# EAGLE design MRF24J40MA Breakout verA (EAGLE 6.4)
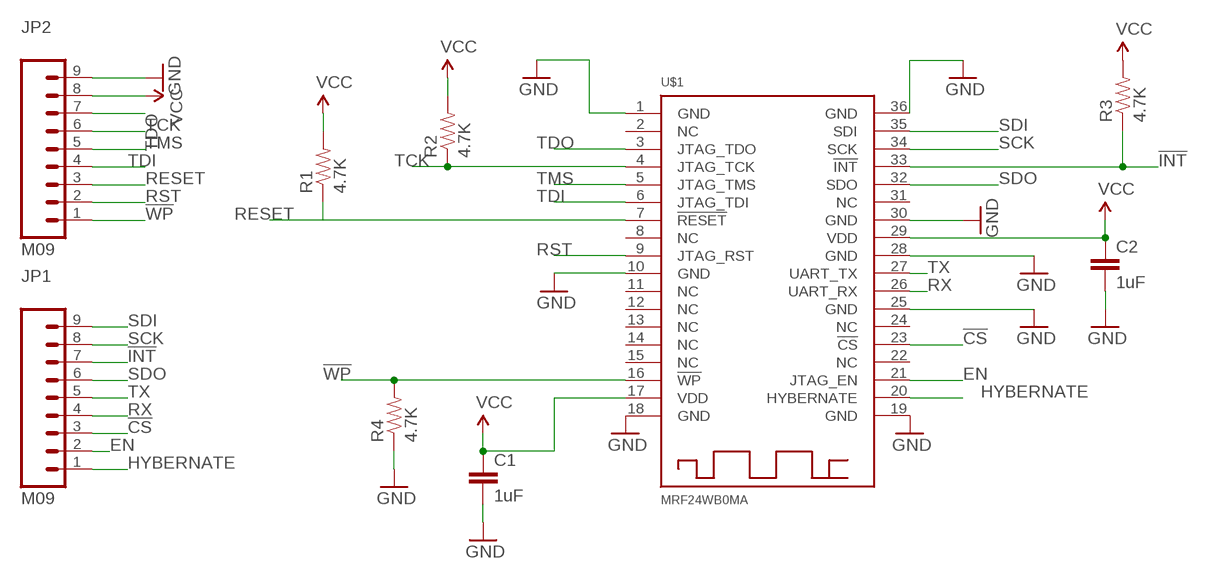
[diagram p0: schematic, sheet 1]

## Parts
C1  1uF  CAP0603-CAP  [0603-CAP]
C2  1uF  CAP0603-CAP  [0603-CAP]
JP1  M09  [1X09]
JP2  M09  [1X09]
R1  4.7K  RESISTOR0603-RES  [0603-RES]
R2  4.7K  RESISTOR0603-RES  [0603-RES]
R3  4.7K  RESISTOR0603-RES  [0603-RES]
R4  4.7K  RESISTOR0603-RES  [0603-RES]
U$1  MRF24WB0MA  [MRF24WB0MA]

## Nets
!CS: JP1.3 U$1.23(!CS)
!INT: JP1.7 R3.1 U$1.33(!INT)
!WP: JP2.1 R4.2 U$1.16(!WP)
EN: JP1.2 U$1.21(JTAG_EN)
GND: C1.2 C2.2 JP2.9 R4.1 U$1.1(GND) U$1.10(GND) U$1.18(GND) U$1.19(GND) U$1.25(GND) U$1.28(GND) U$1.30(GND) U$1.36(GND)
HYBERNATE: JP1.1 U$1.20(HYBERNATE)
RESET: JP2.3 R1.1 U$1.7(!RESET)
RST: JP2.2 U$1.9(JTAG_RST)
RX: JP1.4 U$1.26(UART_RX)
SCK: JP1.8 U$1.34(SCK)
SDI: JP1.9 U$1.35(SDI)
SDO: JP1.6 U$1.32(SDO)
TCK: JP2.6 R2.1 U$1.4(JTAG_TCK)
TDI: JP2.4 U$1.6(JTAG_TDI)
TDO: JP2.7 U$1.3(JTAG_TDO)
TMS: JP2.5 U$1.5(JTAG_TMS)
TX: JP1.5 U$1.27(UART_TX)
VCC: C1.1 C2.1 JP2.8 R1.2 R2.2 R3.2 U$1.17(VDD) U$1.29(VDD)
Unconnected: U$1.2(NC) U$1.8(NC) U$1.11(NC) U$1.12(NC) U$1.13(NC) U$1.14(NC) U$1.15(NC) U$1.22(NC) U$1.24(NC) U$1.31(NC)

## Library data of the parts
C1 C2 = SparkFun-Passives:CAP: Capacitor Standard 0603 ceramic capacitor, and 0.1" leaded capacitor.
JP1 JP2 = SparkFun-Connectors:M09: Header 9 Standard 9-pin 0.1" header. Use with straight break away headers (SKU : PRT-00116), right angle break away headers (PRT-00553), swiss pins (PRT-00743), machine pins (PRT-00117), and female headers (PRT-00115).
R1-R4 = SparkFun-Passives:RESISTOR: Resistor Basic schematic elements and footprints for 0603, 1206, and PTH resistors.
U$1 = mrf24wb0ma:MRF24WB0MA

## Board
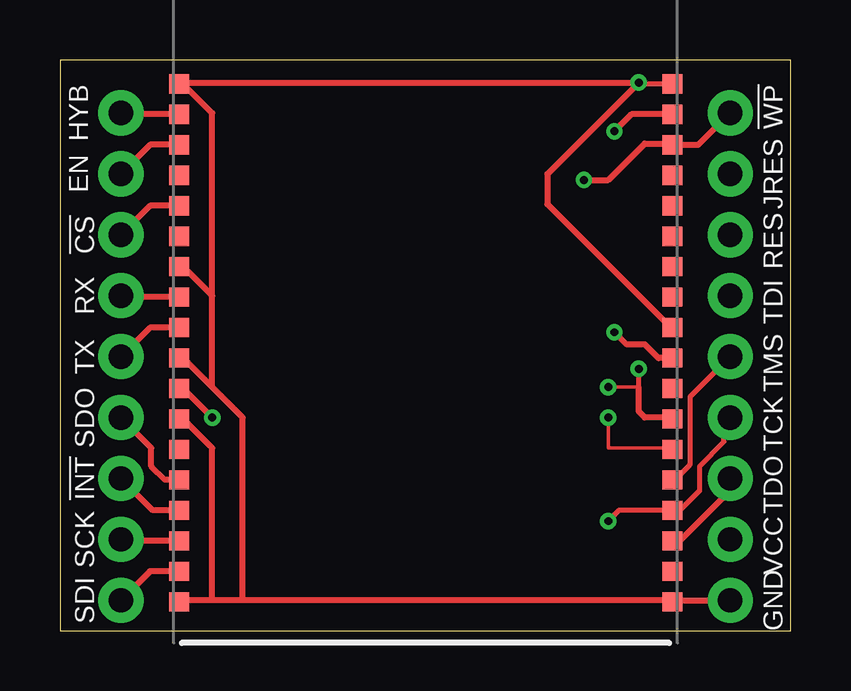
[diagram p1: board, top side]
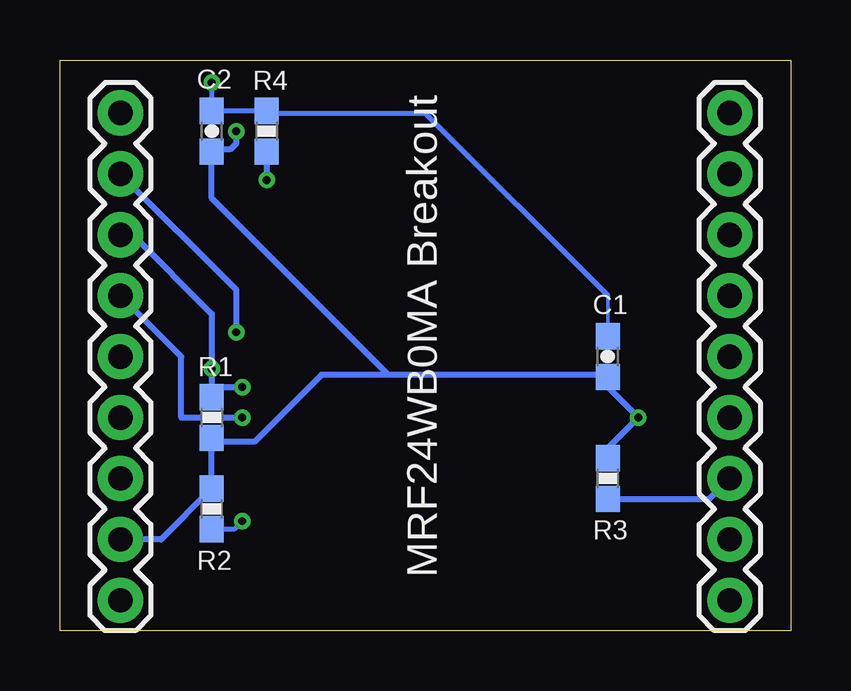
[diagram p2: board, bottom side, seen from below]

Size 30.46 x 23.8 mm. Coordinates in mm from the lower left corner, seen from the top.
Outline: 0,0 30.46,0 30.46,23.8 0,23.8 0,0
Copper layers (1*16): Top 0.0356mm / dielectric 1.5011mm / Bottom 0.0356mm
Design rules "LaenPCBOrder": minimum track width 6mil, minimum drill 13mil, track to track 6mil, track to pad 6mil, pad to pad 6mil, via to via 6mil, smd to smd 6mil, copper to edge 15mil, drill to drill 6mil, minimum pad ring 7mil, minimum via ring 7mil, stop-mask expansion 4mil, vias tented up to drill 13mil, thermal gap 10mil

### Footprints (pad centres in the part's own frame; a part is rotated, then mirrored left to right if it is on the bottom)
0603-CAP = smd 1.1 x 1: 1 -0.85,0; 2 0.85,0
1X09 = drill 1.016 pad 1.88: 1 0,0; 2 2.54,0; 3 5.08,0; 4 7.62,0; 5 10.16,0; 6 12.7,0; 7 15.24,0; 8 17.78,0; 9 20.32,0
0603-RES = smd 1.1 x 1: 1 -0.85,0; 2 0.85,0
MRF24WB0MA = smd 0.85 x 0.8: 1 -10.29,12.76; 2 -10.29,11.49; 3 -10.29,10.22; 4 -10.29,8.95; 5 -10.29,7.68; 6 -10.29,6.41; 7 -10.29,5.14; 8 -10.29,3.87; 9 -10.29,2.6; 10 -10.29,1.33; 11 -10.29,0.06; 12 -10.29,-1.21; 13 -10.29,-2.48; 14 -10.29,-3.75; 15 -10.29,-5.02; 16 -10.29,-6.29; 17 -10.29,-7.56; 18 -10.29,-8.83; 19 10.27,-8.83; 20 10.27,-7.56; 21 10.27,-6.29; 22 10.27,-5.02; 23 10.27,-3.75; 24 10.27,-2.48; 25 10.27,-1.21; 26 10.27,0.06; 27 10.27,1.33; 28 10.27,2.6; 29 10.27,3.87; 30 10.27,5.14; 31 10.27,6.41; 32 10.27,7.68; 33 10.27,8.95; 34 10.27,10.22; 35 10.27,11.49; 36 10.27,12.76

### Placement (x,y rotation side)
C1  7.62,11.43 90 bottom
C2  24.13,20.83 90 bottom
JP1  2.54,21.59 270 bottom
JP2  27.94,21.59 270 bottom
R1  24.13,8.89 270 bottom
R2  24.13,5.08 90 bottom
R3  7.62,6.35 90 bottom
R4  21.84,20.83 270 bottom
U$1  15.24,13.97 180 top

### Tracks (layer width: path | path; a pad name or v marks a point on that pad's centre or on a via)
!CS
  Top 0.254: U$1.23 3.75,17.72 JP1.3
!INT
  Top 0.254: U$1.33 3.87,5.02 JP1.7
  Bottom 0.254: R3.1 3.39,5.5 JP1.7
!WP  (via drill 0.33)
  Top 0.203: 25.47,20.32 U$1.16
  Top 0.254: U$1.16 26.61,20.26 JP2.1 | v21.84,18.8 22.86,18.8 24.38,20.32 25.47,20.32
  Bottom 0.254: R4.2 v21.84,18.8
EN
  Top 0.254: U$1.21 3.75,20.26 JP1.2
GND  (via drill 0.33)
  Top 0.152: 25.4,12.7 U$1.10 | 5.08,1.27 U$1.36 | 25.4,1.27 U$1.1 | 5.08,8.89 U$1.30 | 5.08,11.43 U$1.28 | 5.08,15.24 U$1.25 | 5.08,22.86 U$1.19
  Top 0.203: U$1.18 24.32,22.8 v24.13,22.86
  Top 0.254: 25.4,12.7 20.32,17.78 20.32,19.05 v24.13,22.86 5.08,22.86 6.35,21.59 6.35,13.97 | 25.4,1.27 7.62,1.27 | 7.62,1.27 6.35,1.27 | 6.35,1.27 5.08,1.27 | 5.08,8.89 6.35,7.62 6.35,1.27 | 6.35,10.16 7.62,8.89 7.62,1.27 | 6.35,10.16 5.08,11.43 | 6.35,13.97 5.08,15.24 | 6.35,10.16 6.35,13.97 | U$1.1 25.59,1.27 JP2.9
  Bottom 0.152: 7.62,13.97 C1.2 | 21.59,21.59 R4.1
  Bottom 0.203: v24.13,22.86 C2.2 R4.1 | 7.62,13.97 15.24,21.59 21.59,21.59
HYBERNATE
  Top 0.254: U$1.20 2.6,21.53 JP1.1
RESET  (via drill 0.33)
  Top 0.152: v22.86,10.16 24.13,10.16
  Top 0.203: U$1.7 25.47,8.89 | 24.13,10.16 v24.13,10.92
  Top 0.254: 25.47,8.89 24.38,8.89 24.13,9.14 24.13,10.16
  Bottom 0.203: 24.13,10.16 R1.1
  Bottom 0.254: v22.86,10.16 24.13,10.16 24.13,12.7 24.13,13.21 27.43,16.51 JP2.3
RST  (via drill 0.33)
  Top 0.254: U$1.9 24.95,11.37 24.38,11.94 23.62,11.94 v23.11,12.45
  Bottom 0.254: JP2.2 23.11,14.22 v23.11,12.45
RX
  Top 0.254: U$1.26 2.6,13.91 JP1.4
SCK
  Top 0.254: U$1.34 2.6,3.75 JP1.8
SDI
  Top 0.254: U$1.35 3.75,2.48 JP1.9
SDO
  Top 0.254: U$1.32 4.38,6.29 3.81,6.86 3.81,7.62 JP1.6
TCK  (via drill 0.33)
  Top 0.203: v22.86,4.57 23.31,5.02 U$1.4 25.85,5.02 26.67,5.84 26.67,6.86 27.69,7.87 27.69,8.64 JP2.6
  Bottom 0.203: v22.86,4.57 23.2,4.23 R2.1
TDI  (via drill 0.33)
  Top 0.152: v22.86,8.89 22.86,7.62 25.4,7.62 U$1.6
  Bottom 0.254: v22.86,8.89 25.4,8.89 25.4,11.43 JP2.4
TDO
  Top 0.254: JP2.7 27.94,5.84 25.85,3.75 U$1.3
TMS
  Top 0.203: U$1.5 25.63,6.29 26.26,6.92 26.26,9.75 JP2.5
TX
  Top 0.254: U$1.27 3.75,12.64 JP1.5
VCC  (via drill 0.33)
  Top 0.152: 5.08,10.16 U$1.29
  Top 0.254: U$1.17 23.82,21.53 v23.11,20.83 | v6.35,8.89 5.08,10.16
  Bottom 0.152: 24.13,20.32 C2.1 | 7.87,10.67 C1.1
  Bottom 0.203: 24.04,20.07 C2.1
  Bottom 0.254: v23.11,20.83 23.11,20.32 23.37,20.07 24.04,20.07 | C2.1 24.13,18.03 16.76,10.67 | R3.2 7.62,7.62 v6.35,8.89 7.62,10.16 C1.1 | 7.87,10.67 16.76,10.67 | 16.76,10.67 19.56,10.67 22.35,7.87 23.96,7.87 R1.2 R2.2 26.25,3.81 JP2.8

### Text on the board
tPlace: HYB | !WP | EN | JRES | !CS | RES | RX | TDI | TX | TMS | SDO | TCK | !INT | TDO | SCK | VCC | SDI | GND
bPlace: MRF24WB0MA Breakout